# Altium schematic sheet ActiTouch.SchDoc
size A4; SheetNumber: 1; SheetTotal: 5
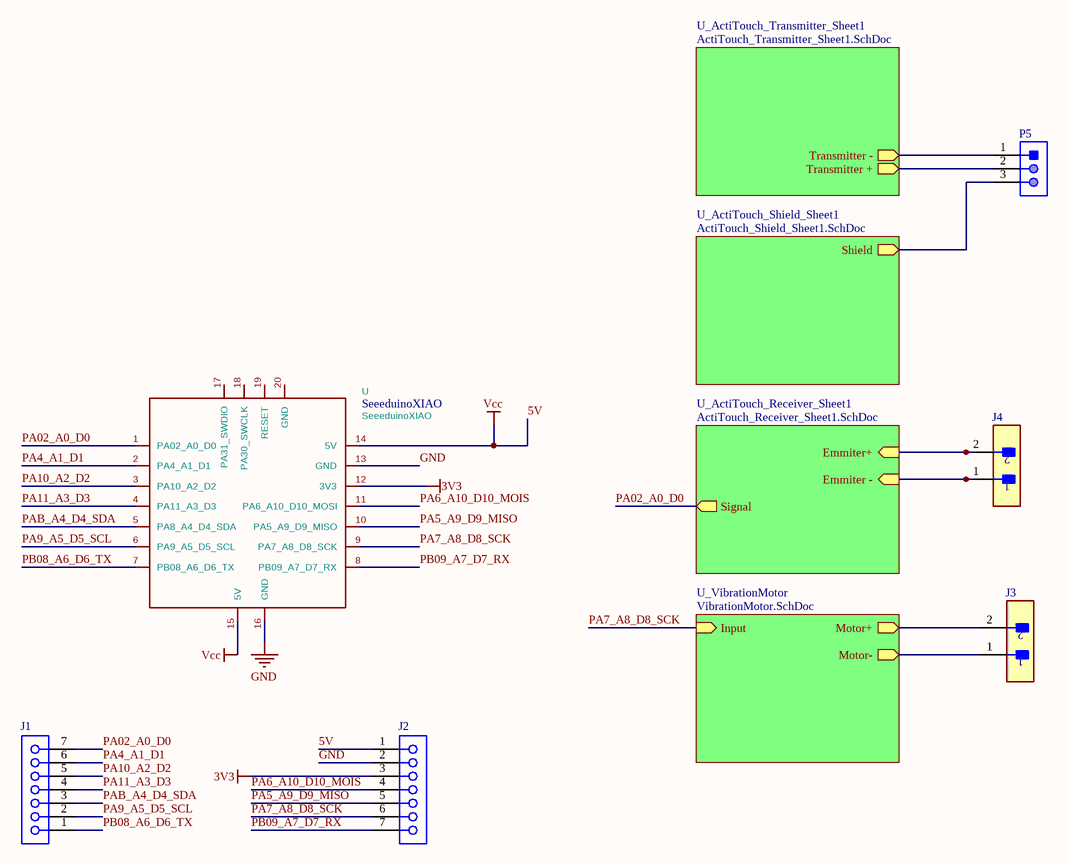
[diagram p0: ActiTouch.SchDoc]

## Parts
J1  SSQ-107-01-G-S  [SMTC-SSQ-107-01-X-S]  (value not drawn)
J2  SSQ-107-01-G-S  [SMTC-SSQ-107-01-X-S]  (value not drawn)
J3  GRPB021VWVN-RC  [FP-GRPB021VWVN-RC-MFG]  (value not drawn)
J4  GRPB021VWVN-RC  [FP-GRPB021VWVN-RC-MFG]  (value not drawn)
P5  GRPB031VWVN-RC  [SLIN-GRPB031VWVN-RC_V]  (value not drawn)
U  SeeeduinoXIAO  [Seeeduino XIAO-MOUDLE14P-2.54-21X17.8MM]

## Sub-sheets
U_ActiTouch_Receiver_Sheet1 = ActiTouch_Receiver_Sheet1.SchDoc: Emmiter+ (in), Emmiter - (in), Signal (out)
U_ActiTouch_Shield_Sheet1 = ActiTouch_Shield_Sheet1.SchDoc: Shield (out)
U_ActiTouch_Transmitter_Sheet1 = ActiTouch_Transmitter_Sheet1.SchDoc: Transmitter + (out), Transmitter - (out)
U_VibrationMotor = VibrationMotor.SchDoc: Input (in), Motor+ (out), Motor- (out)

## Nets
3V3: J2.3 U.12(3V3)
5V: J2.1 U.14(5V) U.15(5V)  [also labelled Vcc]
GND: J2.2 U.13(GND) U.16(GND)
PA02_A0_D0: J1.7 U.1(PA02_A0_D0) ; sheet U_ActiTouch_Receiver_Sheet1/Signal
PA4_A1_D1: J1.6 U.2(PA4_A1_D1)
PA5_A9_D9_MISO: J2.5 U.10(PA5_A9_D9_MISO)
PA6_A10_D10_MOIS: J2.4 U.11(PA6_A10_D10_MOSI)
PA7_A8_D8_SCK: J2.6 U.9(PA7_A8_D8_SCK) ; sheet U_VibrationMotor/Input
PA9_A5_D5_SCL: J1.2 U.6(PA9_A5_D5_SCL)
PA10_A2_D2: J1.5 U.3(PA10_A2_D2)
PA11_A3_D3: J1.4 U.4(PA11_A3_D3)
PAB_A4_D4_SDA: J1.3 U.5(PA8_A4_D4_SDA)
PB08_A6_D6_TX: J1.1 U.7(PB08_A6_D6_TX)
PB09_A7_D7_RX: J2.7 U.8(PB09_A7_D7_RX)
NetJ3_1: J3.1 ; sheet U_VibrationMotor/Motor-
NetJ3_2: J3.2 ; sheet U_VibrationMotor/Motor+
NetJ4_1: J4.1 ; sheet U_ActiTouch_Receiver_Sheet1/Emmiter -
NetJ4_2: J4.2 ; sheet U_ActiTouch_Receiver_Sheet1/Emmiter+
NetP5_1: P5.1 ; sheet U_ActiTouch_Transmitter_Sheet1/Transmitter -
NetP5_2: P5.2 ; sheet U_ActiTouch_Transmitter_Sheet1/Transmitter +
NetP5_3: P5.3 ; sheet U_ActiTouch_Shield_Sheet1/Shield

Not connected (* = marked no-connect by the designer): U 17(PA31_SWDIO) 18(PA30_SWCLK) 19(RESET) 20(GND)

## Library data of the parts
J1 J2 = CMP-1023-00284-1: SQ Post Socket, Through-hole, Vertical, -55 to 125 degC, 2.54 mm Pitch, 7-Pin, Female, RoHS; Manufacturer: Samtec; Pitch: 2.54 mm; PackageDescription: Assembly, Socket Strip .025[0.64] SQ Tail; PartNumber: SSQ-107-01-G-S; PackageReference: SSQ-107-01-X-S; ComponentLink2URL: http://www.samtec.com/documents/webfiles/pdf/SSQ_TH.PDF; ComponentLink1URL: http://www.samtec.com; ComponentLink3Description: Package Specification; PackageVersion: BD, 6/1987; RoHS: True; DatasheetVersion: F-214; Mounting Technology: Through-hole; ComponentLink3URL: http://www.samtec.com/documents/webfiles/cpdf/SSQ-1XX-XX-XXX-X-XX-XXX-XX-X-MKT.pdf; ComponentLink1Description: Manufacturer URL; Temperature Range: -55 to 125 degC; Orientation: Vertical; ComponentLink2Description: Datasheet
J3 J4 = CMP-2000-06371-2: CONN HEADER VERT 2POS 1.27MM; Number of Positions: 2; Connector Type: Male Pin; Pitch: 0.05inch; Contact Plating: Gold; Lead Free: Lead Free; Termination: Solder; Packaging: Bulk; RoHS Compliant: Yes; Contact Type: Male Pin; Mount: Through Hole; Number of Rows: 1; Contact Mating Length: 0.118inch; Package Quantity: 1
P5 = CMP-2000-06372-1: Male Header, Pitch 1.27 mm, 1 x 3 Position, Height 4 mm, Tail Length 2.3 mm, -40 to 105 degC, RoHS, Bulk; Manufacturer: Sullins; Other Names: S9014E-03; Number of Positions: 3; Connector Type: Header,Unshrouded; Pitch: 0.050"(1.27mm); Dynamic Catalog: GRPB; Catalog Drawings: S9014ESeriesTop; Mating Products: S9010E-03-ND / -CONNHEADER.050"3POSR/APCB / S9008E-03-ND / -CONNHEADER.050"3POSPCBGOLD / S9005E-03-ND / -CONNHEADER.050"3POSSMDGOLD; Number of Positions Loaded: All; Contact Finish: Gold; Mounting Type: ThroughHole; Termination: Solder; Packaging: Bulk; Category: Connectors,Interconnects; Package Description: Male Header, Pitch 1.27 mm, 1 x 3 Position, Height 4 mm, Tail Length 2.3 mm; Standard Package: 1; Datasheet URL: http://www.sullinscorp.com/drawings/71_GRPB___1VWVN-RC,_10957-C.pdf; Package Reference: GRPB031VWVN-RC; Family: RectangularConnectors-Headers,MalePins; Number of Rows: 1; Contact Type: MalePin; Manufacturer URL: http://www.sullinscorp.com/; Mounting Technology: ThroughHole; Contact Mating Length: 0.118"(3.00mm); Contact Finish Thickness: Flash; Datasheet Version: Rev. C, 12/2008
U = SeeeduinoXIAO: Value: SeeeduinoXIAO